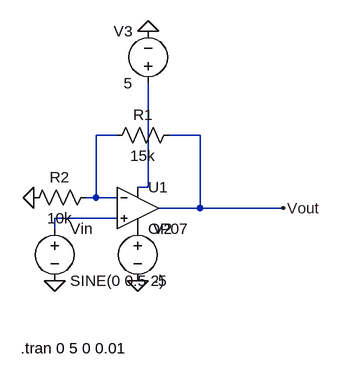
[diagram p0: schematic AmplifierBlock.asc]
AmplifierBlock.asc, the LTspice schematic file:
Version 4
SHEET 1 880 680
WIRE -16 32 -48 32
WIRE 112 32 64 32
WIRE 32 112 32 -48
WIRE 32 112 16 112
WIRE -48 128 -48 32
WIRE -48 128 -64 128
WIRE -16 128 -48 128
WIRE 112 144 112 32
WIRE 112 144 48 144
WIRE 240 144 112 144
WIRE -16 160 -112 160
WIRE -112 176 -112 160
FLAG 32 -128 0
FLAG -144 128 0
FLAG 16 256 0
FLAG 240 144 Vout
FLAG -112 256 0
SYMBOL OpAmps\\OP07 16 80 R0
SYMATTR InstName U1
SYMBOL voltage -112 160 R0
WINDOW 123 0 0 Left 0
WINDOW 39 0 0 Left 0
SYMATTR InstName Vin
SYMATTR Value SINE(0 0.5 2)
SYMBOL voltage 16 160 R0
WINDOW 123 0 0 Left 0
WINDOW 39 0 0 Left 0
SYMATTR InstName V2
SYMATTR Value -5
SYMBOL voltage 32 -32 R180
WINDOW 0 24 96 Left 2
WINDOW 3 24 16 Left 2
WINDOW 123 0 0 Left 0
WINDOW 39 0 0 Left 0
SYMATTR InstName V3
SYMATTR Value 5
SYMBOL res 80 16 R90
WINDOW 0 0 56 VBottom 2
WINDOW 3 32 56 VTop 2
SYMATTR InstName R1
SYMATTR Value 15k
SYMBOL res -48 112 R90
WINDOW 0 0 56 VBottom 2
WINDOW 3 32 56 VTop 2
SYMATTR InstName R2
SYMATTR Value 10k
TEXT -164 360 Left 2 !.tran 0 5 0 0.01

The netlist it stands for:
* AmplifierBlock.asc
XU1 N003 N001 N002 P001 Vout LT1001  ; OP07, pins In+ In- V+ V- OUT
Vin N003 0 SINE(0 0.5 2)
V2 P001 0 -5
V3 N002 0 5
R1 Vout N001 15k
R2 N001 0 10k
.tran 0 5 0 0.01
.lib LTC.lib
.backanno
.end